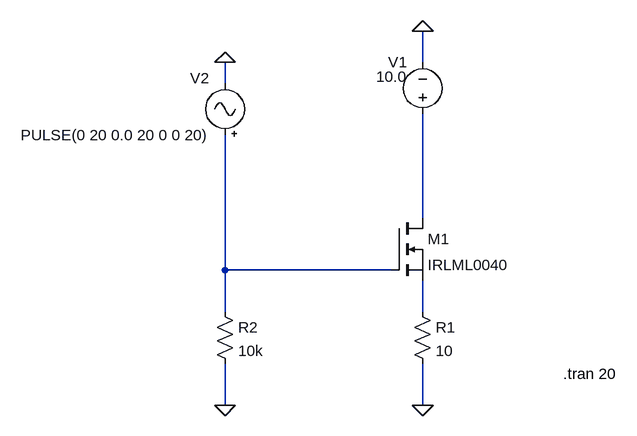
[diagram p0: schematic MOSFET_Characteristics.asc]
MOSFET_Characteristics.asc, the LTspice schematic file:
Version 4
SHEET 1 880 680
WIRE 448 -16 448 -64
WIRE 144 16 144 -16
WIRE 448 224 448 64
WIRE 144 304 144 96
WIRE 400 304 144 304
WIRE 144 368 144 304
WIRE 448 368 448 320
WIRE 144 512 144 448
WIRE 448 512 448 448
FLAG 448 512 0
FLAG 144 -16 0
FLAG 144 512 0
FLAG 448 -64 0
SYMBOL nmos 400 224 R0
SYMATTR InstName M1
SYMATTR Value IRLML0040
SYMBOL voltage 448 80 R180
WINDOW 0 24 96 Left 2
WINDOW 3 24 74 Left 2
SYMATTR InstName V1
SYMATTR Value 10.0
SYMBOL signal 144 112 R180
WINDOW 0 24 104 Left 2
WINDOW 3 24 16 Left 2
SYMATTR InstName V2
SYMATTR Value PULSE(0 20 0.0 20 0 0 20)
SYMBOL Res 128 352 R0
SYMATTR InstName R2
SYMATTR Value 10k
SYMBOL Res 432 352 R0
SYMATTR InstName R1
SYMATTR Value 10
TEXT 664 464 Left 2 !.tran 20

The netlist it stands for:
* MOSFET_Characteristics.asc
M1 N001 N002 N003 N003 IRLML0040
V1 N001 0 10.0
V2 N002 0 PULSE(0 20 0.0 20 0 0 20)
R2 N002 0 10k
R1 N003 0 10
.model NMOS NMOS
.model PMOS PMOS
.lib standard.mos
.tran 20
.backanno
.end